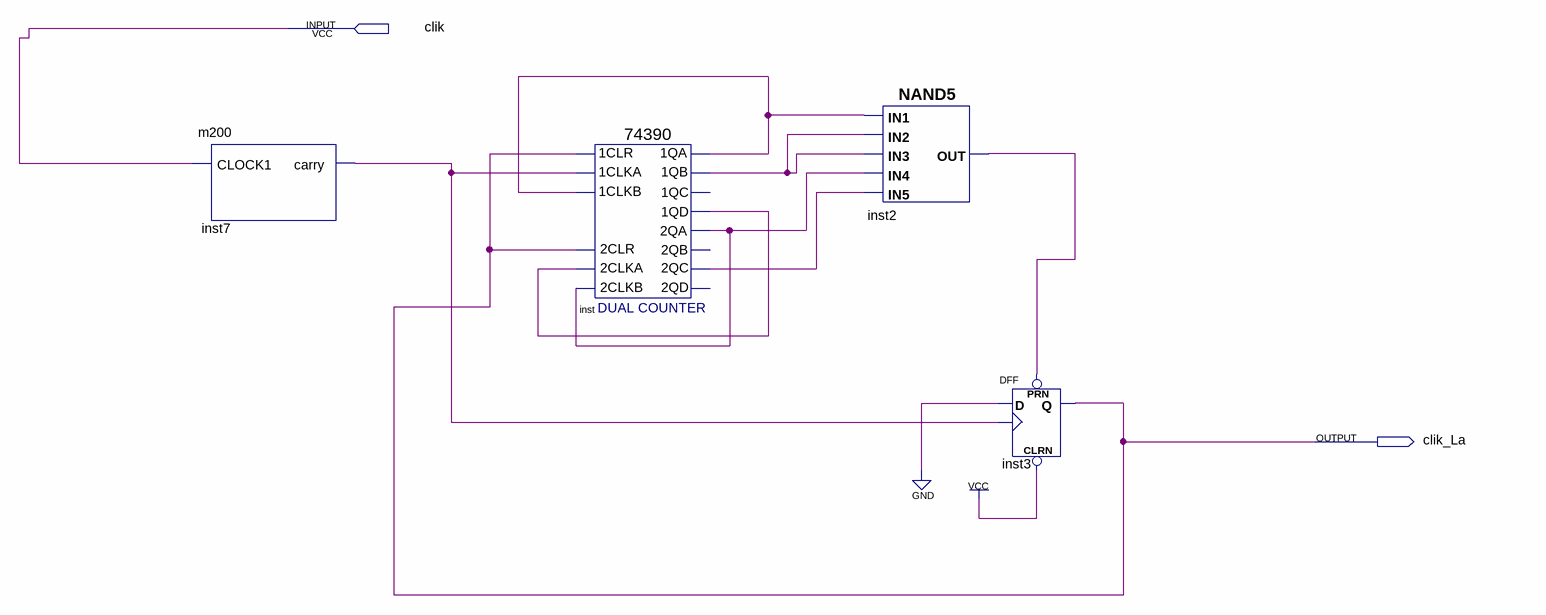
[diagram p0: schematic sheet]
// Quartus schematic La.bdf as structural Verilog: 4 symbols, 2 pins
module La (
  input  clik,
  output clik_La
);

  wire inst2_out, inst7_carry, inst_1qa, inst_1qb, inst_1qd, inst_2qa, inst_2qc;

  m200 inst7 (.CLOCK1(clik), .carry(inst7_carry));
  \74390  inst (
    .\2CLKA (inst_1qd), .\2CLR (clik_La), .\2CLKB (inst_2qa), .\1CLR (clik_La), .\1CLKA (inst7_carry),
    .\1CLKB (inst_1qa), .\1QA (inst_1qa), .\1QB (inst_1qb), .\1QD (inst_1qd), .\2QA (inst_2qa),
    .\2QC (inst_2qc));  // open: 1QC, 2QB, 2QD
  nand inst2 (inst2_out, inst_1qa, inst_1qb, inst_1qb, inst_2qa, inst_2qc);
  DFF inst3 (.CLRN(1'b1), .CLK(inst7_carry), .D(1'b0), .PRN(inst2_out), .Q(clik_La));
endmodule
